# Altium schematic sheet Sheet2.SchDoc
size A
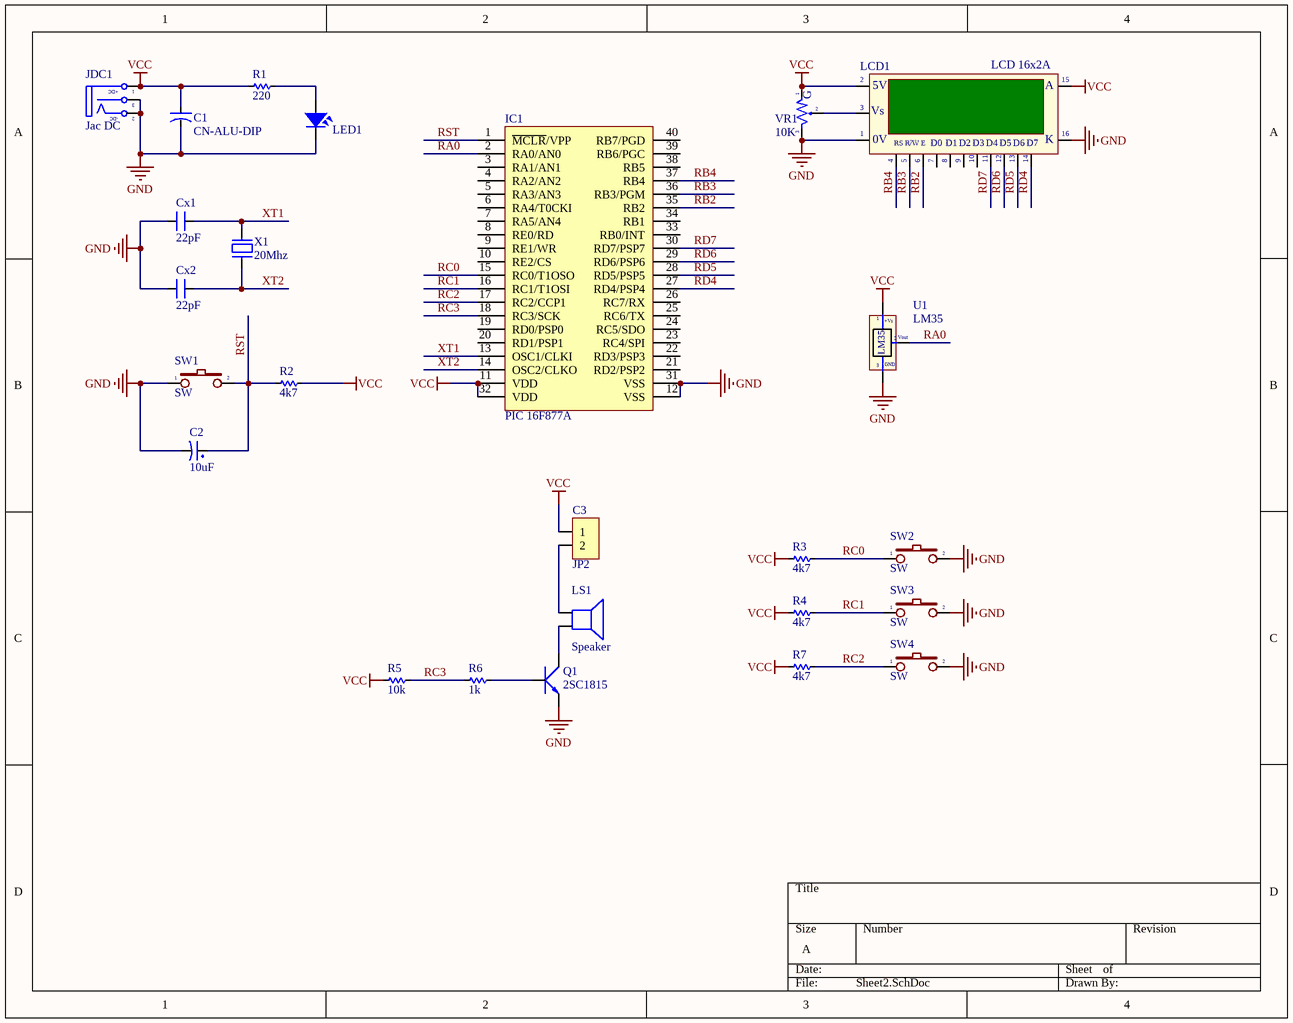
[diagram p0: Sheet2.SchDoc]

## Parts
C1  CN-ALU-DIP  [CA-ALU-8]
C2  10uF  [CP1/2]
C3  JP2  [JP2-CLOSED]
Cx1  22pF  [CN1]
Cx2  22pF  [CN1]
IC1  PIC 16F877A  [DIP40/W0.6]
JDC1  Jac DC  [DC0]
LCD1  LCD 16x2A  [LCD16X2]
LED1  LED  [LED-5-RED]  (value not drawn)
LS1  Speaker  [SPEAKER]
Q1  2SC1815  [TO92-123]
R1  220  [RES-1/4W]
R2  4k7  [RES-1/4W]
R3  4k7  [RES-1/4W]
R4  4k7  [RES-1/4W]
R5  10k  [RES-SMD-0805]
R6  1k  [RES-1/4W]
R7  4k7  [RES-1/4W]
SW1  SW  [SW2]
SW2  SW  [SW2]
SW3  SW  [SW2]
SW4  SW  [SW2]
U1  LM35  [JP3-C1T]
VR1  10K  [VR-S2]
X1  20Mhz  [XT2]

## Nets
GND: C1.2 C2.2 Cx1.1 Cx2.1 IC1.12(VSS) IC1.31(VSS) JDC1.2(TN) JDC1.3(S) LCD1.1(GND) LCD1.16(K) LED1.2 Q1.1(E) SW1.1 SW2.2 SW3.2 SW4.2 U1.3(-) VR1.3
VCC: C1.1 C3.1 IC1.11(VDD) IC1.32(VDD) JDC1.1(T) LCD1.2(VDD) LCD1.15(A) R1.2 R2.1 R3.2 R4.2 R5.2 R7.2 U1.1(+Vs) VR1.1
RA0: IC1.2(RA0/AN0) U1.2(Vout)
RB2: IC1.35(RB2) LCD1.6(~{EN})
RB3: IC1.36(RB3/PGM) LCD1.5(R/~{W})
RB4: IC1.37(RB4) LCD1.4(RS)
RC0: IC1.15(RC0/T1OSO) R3.1 SW2.1
RC1: IC1.16(RC1/T1OSI) R4.1 SW3.1
RC2: IC1.17(RC2/CCP1) R7.1 SW4.1
RC3: IC1.18(RC3/SCK) R5.1 R6.2
RD4: IC1.27(RD4/PSP4) LCD1.14(D7)
RD5: IC1.28(RD5/PSP5) LCD1.13(D6)
RD6: IC1.29(RD6/PSP6) LCD1.12(D5)
RD7: IC1.30(RD7/PSP7) LCD1.11(D4)
RST: C2.1 IC1.1(~{MCLR}/VPP) R2.2 SW1.2
XT1: Cx1.2 IC1.13(OSC1/CLKI) X1.2
XT2: Cx2.2 IC1.14(OSC2/CLKO) X1.1
NetC3_2: C3.2 LS1.1
NetLCD1_3: LCD1.3(VEE) VR1.2
NetLED1_1: LED1.1 R1.1
NetLS1_2: LS1.2 Q1.2(C)
NetQ1_3: Q1.3(B) R6.1

Not connected (* = marked no-connect by the designer): IC1 3(RA1/AN1) 4(RA2/AN2) 5(RA3/AN3) 6(RA4/T0CKI) 7(RA5/AN4) 8(RE0/RD) 9(RE1/WR) 10(RE2/CS) 19(RD0/PSP0) 20(RD1/PSP1) 21(RD2/PSP2) 22(RD3/PSP3) 23(RC4/SPI) 24(RC5/SDO) 25(RC6/TX) 26(RC7/RX) 33(RB0/INT) 34(RB1) 38(RB5) 39(RB6/PGC) 40(RB7/PGD); LCD1 7(D0) 8(D1) 9(D2) 10(D3)

## Notes on the sheet
- (in symbol DCIN) +DC; -DC
- (in symbol LCD16x2A) 5V; Vs; |; 0V; R/W; E
- (in symbol LM35) GND
- (in symbol VR-S) G

## Library data of the parts
C1 = CN-ALU-DIP: Capacitor (Semiconductor SIM Model); Value: 104; LatestRevisionDate: 17-Jul-2002; LatestRevisionNote: Re-released for DXP Platform.; PackageReference: C1206; Publisher: Altium Limited
C2 = CP1: Cap P  0,1uF < 22uF , 16 - 50V; Value: 10uF/50V; Description 1: 10 => 220uF/6,3V/10V - 10uF => 100uF/16V; Description 2: 0,1uF => 33uF/50V - 10uF => 22uF/63V; Description 3: 0,47uF => 10uF/100V
C3 = JP2: WR-PHD 2.54 mm Angled Socket Header; Manufacturer: W¨¹rth Elektronik eiSos GmbH; partNo: 613002143121; ComponentLink1 Description: Manufacturer; ComponentLink2 Description: Datasheet; NoPins: 02; Created Date: 29 March 2013; ComponentLink1URL: http://www.we-online.com; ComponentLink2URL: http://katalog.we-online.de/em/datasheet/6130xx143121.pdf; Created by: Karrer Zheng
Cx1 Cx2 = CN: Value: 33pF
IC1 = PIC16F877-PU: 8K FLASH, 368B RAM, 256B EFROM; Value: DIP 40; Value: PIC16F877A; Copyright by: VanDungEvn
JDC1 = DCIN: Jac DC input; Value: Jac DC
LCD1 = LCD16x2A: LCD dipslay 16 char, 2 line; Value: LCD16x2A
LED1 = LED: LED Single colour Green and Red; Value: LED 3 ly Single Colour
LS1 = Speaker: Loudspeaker; Published: 24-Mar-1999; LatestRevisionDate: 17-Jul-2002; LatestRevisionNote: Re-released for DXP Platform.; PackageReference: PIN2; Publisher: Altium Limited
Q1 = 2SC1815: NPN 600mW, ECB; Value: C1815
R1-R4 R6 R7 = Res: Manufacturer: Generic Components; Class: Passive; SubClass: R; Published: 08/06/2000; Publisher: Altium Hobart Technology Centre
R5 = Res-SMD: Resistor; Manufacturer: Generic Components; Class: Passive; Published: 08/06/2000; Publisher: Altium Hobart Technology Centre
SW1-SW4 = SW2: Switch button 2 pin; Value: SW chip 2 pin
U1 = LM35: Teminal; Value: LM35
VR1 = VR-S: Var Resistor; Value: Volume 50k
X1 = XT2: Crystal, 32.768 KHz, -40 to 85 degC, 3.2 x 1.5 x 0.9 mm SMD; Value: 4Mhz